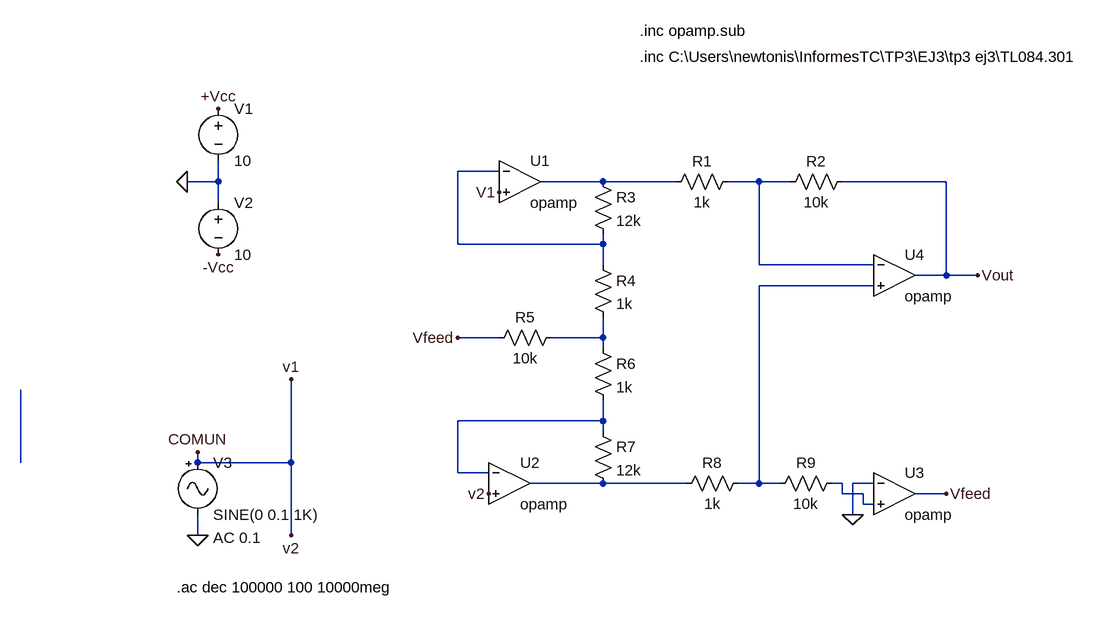
[diagram p0: schematic final_ari.asc]
final_ari.asc, the LTspice schematic file:
Version 4
SHEET 1 964 784
WIRE 48 128 -16 128
WIRE -384 144 -384 112
WIRE -384 144 -432 144
WIRE 208 144 112 144
WIRE 320 144 208 144
WIRE 448 144 400 144
WIRE 496 144 448 144
WIRE 736 144 576 144
WIRE -384 176 -384 144
WIRE -16 240 -16 128
WIRE 208 240 208 224
WIRE 208 240 -16 240
WIRE 208 272 208 240
WIRE 448 272 448 144
WIRE 624 272 448 272
WIRE 736 288 736 144
WIRE 736 288 688 288
WIRE 784 288 736 288
WIRE 624 304 448 304
WIRE 48 384 -16 384
WIRE 208 384 208 352
WIRE 208 384 128 384
WIRE 208 400 208 384
WIRE 208 512 208 480
WIRE 208 512 -16 512
WIRE 208 528 208 512
WIRE -688 576 -688 464
WIRE -416 576 -416 560
WIRE -272 576 -272 448
WIRE -272 576 -416 576
WIRE -16 592 -16 512
WIRE 32 592 -16 592
WIRE 208 608 96 608
WIRE 336 608 208 608
WIRE 448 608 448 304
WIRE 448 608 416 608
WIRE 480 608 448 608
WIRE 576 608 560 608
WIRE 624 608 592 608
WIRE 576 624 576 608
WIRE 608 624 576 624
WIRE 736 624 688 624
WIRE 608 640 608 624
WIRE 624 640 608 640
WIRE 592 656 592 608
WIRE -416 688 -416 656
WIRE -272 688 -272 576
FLAG -16 384 Vfeed
FLAG 736 624 Vfeed
FLAG -416 688 0
FLAG -272 448 v1
FLAG 32 624 v2
FLAG -272 688 v2
FLAG 784 288 Vout
FLAG -432 144 0
FLAG -384 32 +Vcc
FLAG -384 256 -Vcc
FLAG 592 656 0
FLAG -416 560 COMUN
FLAG 48 160 V1
SYMBOL res 192 128 R0
SYMATTR InstName R3
SYMATTR Value 12k
SYMBOL res 192 256 R0
SYMATTR InstName R4
SYMATTR Value 1k
SYMBOL res 192 384 R0
SYMATTR InstName R6
SYMATTR Value 1k
SYMBOL res 192 512 R0
SYMATTR InstName R7
SYMATTR Value 12k
SYMBOL res 416 128 R90
WINDOW 0 0 56 VBottom 2
WINDOW 3 32 56 VTop 2
SYMATTR InstName R1
SYMATTR Value 1k
SYMBOL res 592 128 R90
WINDOW 0 0 56 VBottom 2
WINDOW 3 32 56 VTop 2
SYMATTR InstName R2
SYMATTR Value 10k
SYMBOL res 432 592 R90
WINDOW 0 0 56 VBottom 2
WINDOW 3 32 56 VTop 2
SYMATTR InstName R8
SYMATTR Value 1k
SYMBOL res 576 592 R90
WINDOW 0 0 56 VBottom 2
WINDOW 3 32 56 VTop 2
SYMATTR InstName R9
SYMATTR Value 10k
SYMBOL res 144 368 R90
WINDOW 0 0 56 VBottom 2
WINDOW 3 32 56 VTop 2
SYMATTR InstName R5
SYMATTR Value 10k
SYMBOL voltage -384 16 R0
SYMATTR InstName V1
SYMATTR Value 10
SYMBOL voltage -384 160 R0
SYMATTR InstName V2
SYMATTR Value 10
SYMBOL Misc\\signal -416 560 R0
WINDOW 123 24 132 Left 2
WINDOW 39 0 0 Left 2
SYMATTR Value2 AC 0.1
SYMATTR InstName V3
SYMATTR Value SINE(0 0.1 1K)
SYMBOL Opamps\\opamp 80 80 R0
SYMATTR InstName U1
SYMATTR SpiceLine Aol=1000000K
SYMATTR SpiceLine2 GBW=1000Meg
SYMBOL Opamps\\opamp 64 544 R0
SYMATTR InstName U2
SYMATTR SpiceLine Aol=1000000K
SYMATTR SpiceLine2 GBW=1000Meg
SYMBOL Opamps\\opamp 656 560 R0
SYMATTR InstName U3
SYMATTR SpiceLine Aol=1000000K
SYMATTR SpiceLine2 GBW=1000Meg
SYMBOL Opamps\\opamp 656 224 R0
SYMATTR InstName U4
SYMATTR SpiceLine Aol=200K
SYMATTR SpiceLine2 GBW=3Meg
TEXT -448 768 Left 2 !.ac dec 100000 100 10000meg
TEXT 264 -88 Left 2 !.inc opamp.sub
TEXT 264 -48 Left 2 !.inc C:\\Users\\newtonis\\InformesTC\\TP3\\EJ3\\tp3 ej3\\TL084.301

The netlist it stands for:
* final_ari.asc
R3 N002 N001 12k
R4 N001 N005 1k
R6 N005 N006 1k
R7 N006 N008 12k
R1 N003 N002 1k
R2 Vout N003 10k
R8 N004 N008 1k
R9 N009 N004 10k
R5 N005 Vfeed 10k
V1 +Vcc 0 10
V2 0 -Vcc 10
V3 COMUN 0 SINE(0 0.1 1K) AC 0.1
XU1 N001 COMUN N002 opamp Aol=1000000K GBW=1000Meg  ; pins invin noninvin out
XU2 N006 COMUN N008 opamp Aol=1000000K GBW=1000Meg  ; pins invin noninvin out
XU3 0 N009 Vfeed opamp Aol=1000000K GBW=1000Meg  ; pins invin noninvin out
XU4 N003 N004 Vout opamp Aol=200K GBW=3Meg  ; pins invin noninvin out
.ac dec 100000 100 10000meg
.inc opamp.sub
.inc C:\Users\newtonis\InformesTC\TP3\EJ3\tp3 ej3\TL084.301
.backanno
.end